# Altium project ptalk.PrjPcb
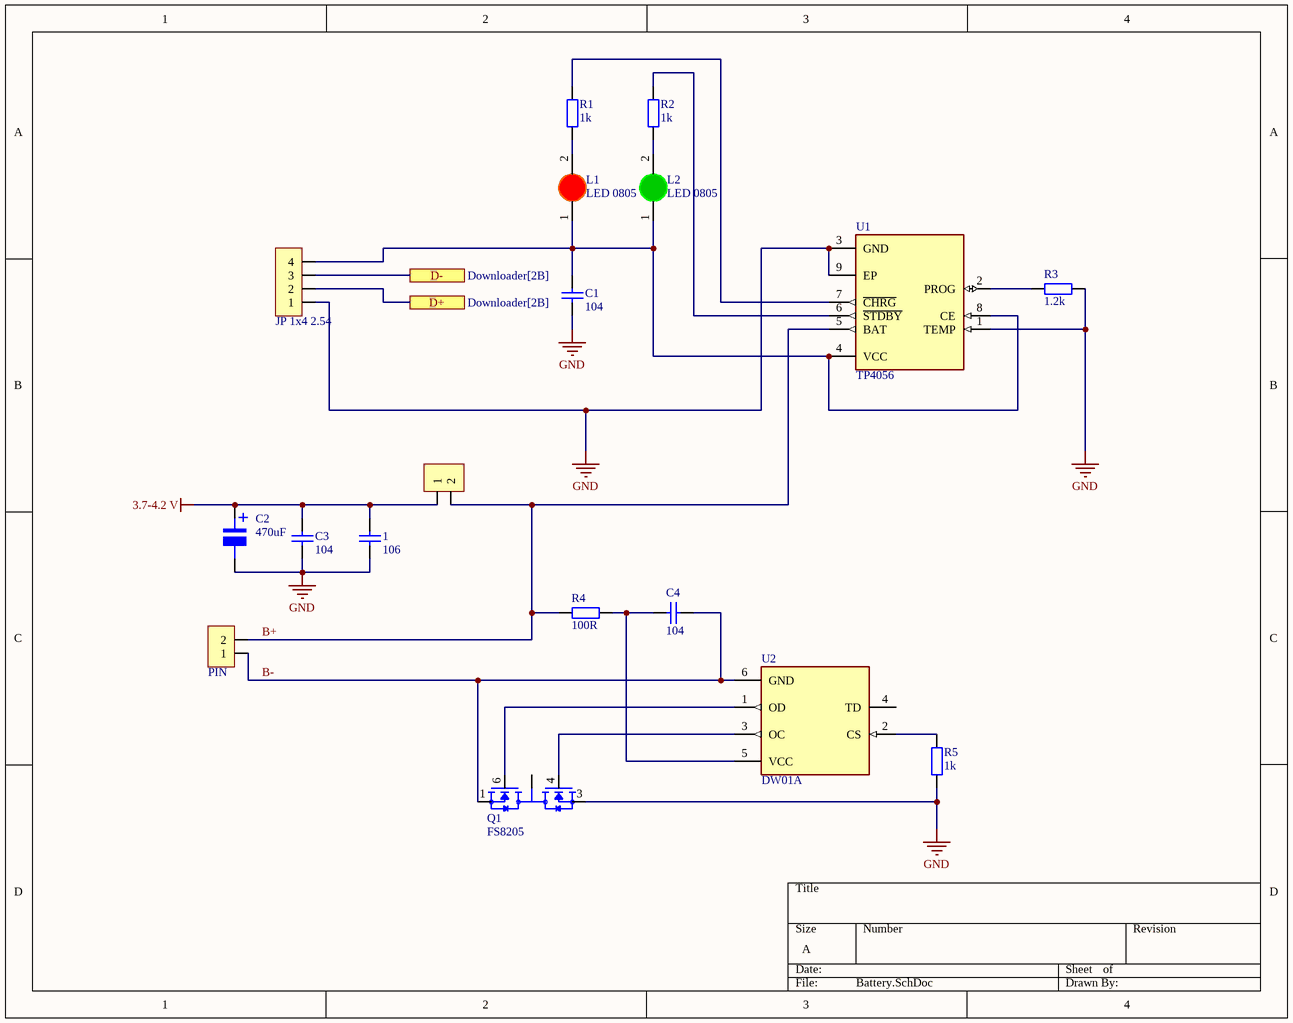
[diagram p0: Battery.SchDoc]
5 sheets, 59 parts. Net scope: flat (ports and power ports of the same name join across sheets).
Board file: PCB.PcbDoc
Sheets:
  Battery.SchDoc
  Source.SchDoc
  Downloader.SchDoc
  Media.SchDoc
  Esp32.SchDoc

## Sheet Battery.SchDoc
size A; SheetNumber: 1; SheetTotal: 5

### Parts
1  106  [tu 0805]
-_+  PIN  [JP 1x2 DT]
C1  104  [tu 0805]
C2  470uF  [tu nhom 8 (f)]
C3  104  [tu 0805]
C4  104  [tu 0805]
congtac  JP 1x2 2.54  [JP 1x2 DT]  (value not drawn)
GND_D+_D-_V  JP 1x4 2.54  [JP 1x4 DT]
L1  LED 0805  [LED-0805-Red]
L2  LED 0805  [LED-0805-Green]
Q1  FS8205  [SOT95P280X145-6N]
R1  1k  [tro smd 0805]
R2  1k  [tro smd 0805]
R3  1.2k  [tro smd 0805]
R4  100R  [tro smd 0805]
R5  1k  [tro smd 0805]
U1  TP4056  [SOP127P600X175-9N]
U2  DW01A  [SOT95P280X145-6N]

### Ports
D+ (see Downloader[2B]), D- (see Downloader[2B])

### Nets
3.7-4.2 V: 1.1 C2.1 C3.1 congtac.1
GND: 1.2 C1.2 C2.2 C3.2 GND_D+_D-_V.1 Q1.3(S2) R3.2 R5.1 U1.1(TEMP) U1.3(GND) U1.9(EP)
B+: -_+.2 congtac.2 R4.1 U1.5(BAT)
B-: -_+.1 C4.1 Q1.1(S1) U2.6(GND)
NetC1_1: C1.1 GND_D+_D-_V.4 L1.1(A) L2.1(A) U1.4(VCC) U1.8(CE)
NetC4_2: C4.2 R4.2 U2.5(VCC)
NetGND_D+_D-_V_2: GND_D+_D-_V.2 ; port D+
NetGND_D+_D-_V_3: GND_D+_D-_V.3 ; port D-
NetL1_2: L1.2(K) R1.1
NetL2_2: L2.2(K) R2.1
NetQ1_2: Q1.2(D12) Q1.5(D12)
NetQ1_4: Q1.4(G2) U2.3(OC)
NetQ1_6: Q1.6(G1) U2.1(OD)
NetR1_2: R1.2 U1.7(~{CHRG})
NetR2_2: R2.2 U1.6(~{STDBY})
NetR3_1: R3.1 U1.2(PROG)
NetR5_2: R5.2 U2.2(CS)

Not connected (* = marked no-connect by the designer): U2 4(TD)

### Notes on the sheet
- (in symbol Tu Nhom 470uF 16V) +

### Library data of the parts
1 = Tu 0805 106 16V 10%: Dán; Ten_Linh_Kien: Tụ 0805 106-10uF 10% 16V; So_Chan: 2; Don_Vi: Con; Ma_Hang: MH004553; Chung_Loai: Dán; Kieu_Chan: *
-_+ congtac = JP 1x2 2.54 Duc Thang: Cắm; Ten_Linh_Kien: Jump Đơn Đực 2.54MM 1x40P Thẳng 11MM; Don_Vi: Con; Ma_Hang: MH000903; Ghi_Chu: *; Kieu_Chan: *; Chung_Loai: Cắm
C1 C3 C4 = Tu 0805 104 50V 10%: Dán; Don_Vi: Con; So_Chan: 2; Ten_Linh_Kien: Tụ 0805 104-100nF 10% 50V; Ma_Hang: MH004551; Chung_Loai: Dán; Kieu_Chan: *
C2 = Tu Nhom 470uF 16V: Dán; Don_Vi: Con; So_Chan: 2; Ten_Linh_Kien: Tụ Nhôm 470uF 16V 8x10.4MM; Ma_Hang: MH001940; Chung_Loai: Dán; Kieu_Chan: *
GND_D+_D-_V = JP 1x4 2.54 Duc Thang: Cắm; Ten_Linh_Kien: Jump Đơn Đực 2.54MM 1x40P Thẳng 11MM; Don_Vi: Con; Ma_Hang: MH000903; Ghi_Chu: *; Kieu_Chan: *; Chung_Loai: Cắm
L1 = LED 0805 Do: Dán; Don_Vi: Con; Ma_Hang: MH000897; Ten_Linh_Kien: LED 0805 Màu Đỏ (Red); Ghi_Chu: *; Kieu_Chan: *; Chung_Loai: Dán
L2 = LED 0805 Xanh La: Dán; Don_Vi: Con; Ma_Hang: MH002326; Ten_Linh_Kien: LED 0805 Màu Xanh Lá (Green); Ghi_Chu: *; Kieu_Chan: *; Chung_Loai: Dán
Q1 = FS8205: ÐœÐžÐŸ-Ñ‚Ñ€Ð°Ð½Ð·Ð¸ÑÑ‚Ð¾Ñ€ Ñ Ð´Ð²Ð¾Ð¹Ð½Ñ‹Ð¼ N-ÐºÐ°Ð½Ð°Ð»ÑŒÐ½Ñ‹Ð¼ Ñ€ÐµÐ¶Ð¸Ð¼Ð¾Ð¼ ÑƒÑÐ¸Ð»ÐµÐ½Ð¸Ñ Ð¼Ð¾Ñ‰Ð½Ð¾ÑÑ‚Ð¸; MF: Fortune Semiconductor; SnapEDA_Link: https://www.snapeda.com/parts/FS8205/Fortune+Semiconductor/view-part/?ref=snap; Package: Package; Value: *; MP: FS8205; Check_prices: https://www.snapeda.com/parts/FS8205/Fortune+Semiconductor/view-part/?ref=eda
R1 R2 R5 = Tro 0805 5% 1k: Dán; Don_Vi: Con; So_Chan: 2; Ten_Linh_Kien: Trở 0805 5% 1k; Ma_Hang: MH005234; Chung_Loai: Dán; Kieu_Chan: *
R3 = Tro 0805 5% 1.2k: Dán; Don_Vi: Con; So_Chan: 2; Ten_Linh_Kien: Trở 0805 5% 1.2k; Ma_Hang: MH005231; Chung_Loai: Dán; Kieu_Chan: *
R4 = Tro 0805 5% 100R: Dán; Don_Vi: Con; So_Chan: 2; Ten_Linh_Kien: Trở 0805 5% 100R; Ma_Hang: MH005251; Chung_Loai: Dán; Kieu_Chan: *
U1 = TP4056: Complete single cell Li-Ion battery with a constant current / constant voltage linear charger; MF: NanJing Top Power ASIC Corp.; Check_prices: https://www.snapeda.com/parts/TP4056/NanJing+Top+Power+ASIC+Corp./view-part/?ref=eda; SnapEDA_Link: https://www.snapeda.com/parts/TP4056/NanJing+Top+Power+ASIC+Corp./view-part/?ref=snap; Price: None; Availability: Not in stock; Package: Package; MP: TP4056; Value: *
U2 = DW01A: One Cell Lithium-ion/Polymer Battery Protection IC; MF: Fortune Semiconductor; SnapEDA_Link: https://www.snapeda.com/parts/DW01A/Fortune+Semiconductor/view-part/?ref=snap; Package: SOT-23-6 Fortune Semiconductor; Value: *; MP: DW01A; Check_prices: https://www.snapeda.com/parts/DW01A/Fortune+Semiconductor/view-part/?ref=eda

## Sheet Source.SchDoc
size A; SheetNumber: 2; SheetTotal: 5
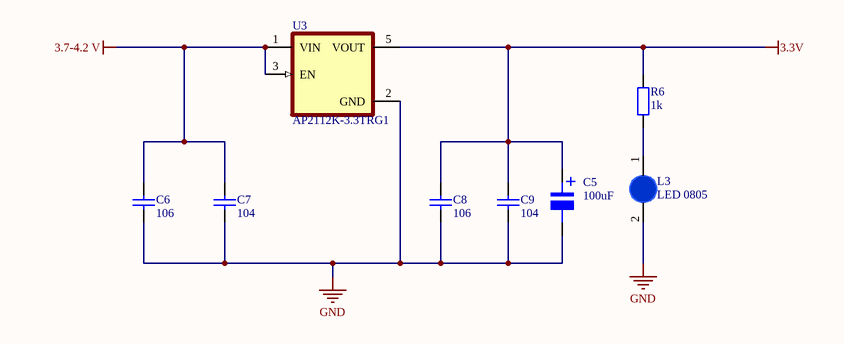
[diagram p1: Source.SchDoc]

### Parts
C5  100uF  [tu nhom 6.3 (d)]
C6  106  [tu 0805]
C7  104  [tu 0805]
C8  106  [tu 0805]
C9  104  [tu 0805]
L3  LED 0805  [LED-0805-Blue]
R6  1k  [tro smd 0805]
U3  AP2112K-3.3TRG1  [SOT95P285X140-5N]

### Nets
3.3V: C5.1 C8.1 C9.1 R6.2 U3.5(VOUT)
3.7-4.2 V: C6.1 C7.1 U3.1(VIN) U3.3(EN)
GND: C5.2 C6.2 C7.2 C8.2 C9.2 L3.2(K) U3.2(GND)
NetL3_1: L3.1(A) R6.1

### Notes on the sheet
- (in symbol Tu Nhom 100uF 16V) +

### Library data of the parts
C5 = Tu Nhom 100uF 16V: Dán; Don_Vi: Con; So_Chan: 2; Ten_Linh_Kien: Tụ Nhôm 100uF 16V 6.3x5.4MM; Ma_Hang: MH002219; Chung_Loai: Dán; Kieu_Chan: *
C6-C9 = Tu 0805 106 16V 10%: as 1 on sheet Battery; Chung_Loai: Dán; Kieu_Chan: *
L3 = LED 0805 Xanh Duong: Dán; Don_Vi: Con; Ma_Hang: MH002327; Ten_Linh_Kien: LED 0805 Màu Xanh Dương (Blue); Ghi_Chu: *; Kieu_Chan: *; Chung_Loai: Dán
R6 = Tro 0805 5% 1k: as R1 on sheet Battery; Chung_Loai: Dán; Kieu_Chan: *
U3 = AP2112K-3.3TRG1: Linear Voltage Regulator IC Positive Fixed 1 Output 600mA SOT-25; MF: Diodes Inc.; Value: *; Purchase-URL: https://pricing.snapeda.com/search/part/AP2112K-3.3TRG1/?ref=eda; Package: SOT-753 Diodes Inc.; Availability: In Stock; Check_prices: https://www.snapeda.com/parts/AP2112K-3.3TRG1/Diodes+Inc./view-part/?ref=eda; Price: None; SnapEDA_Link: https://www.snapeda.com/parts/AP2112K-3.3TRG1/Diodes+Inc./view-part/?ref=snap; MP: AP2112K-3.3TRG1

## Sheet Downloader.SchDoc
size A; SheetNumber: 3; SheetTotal: 5
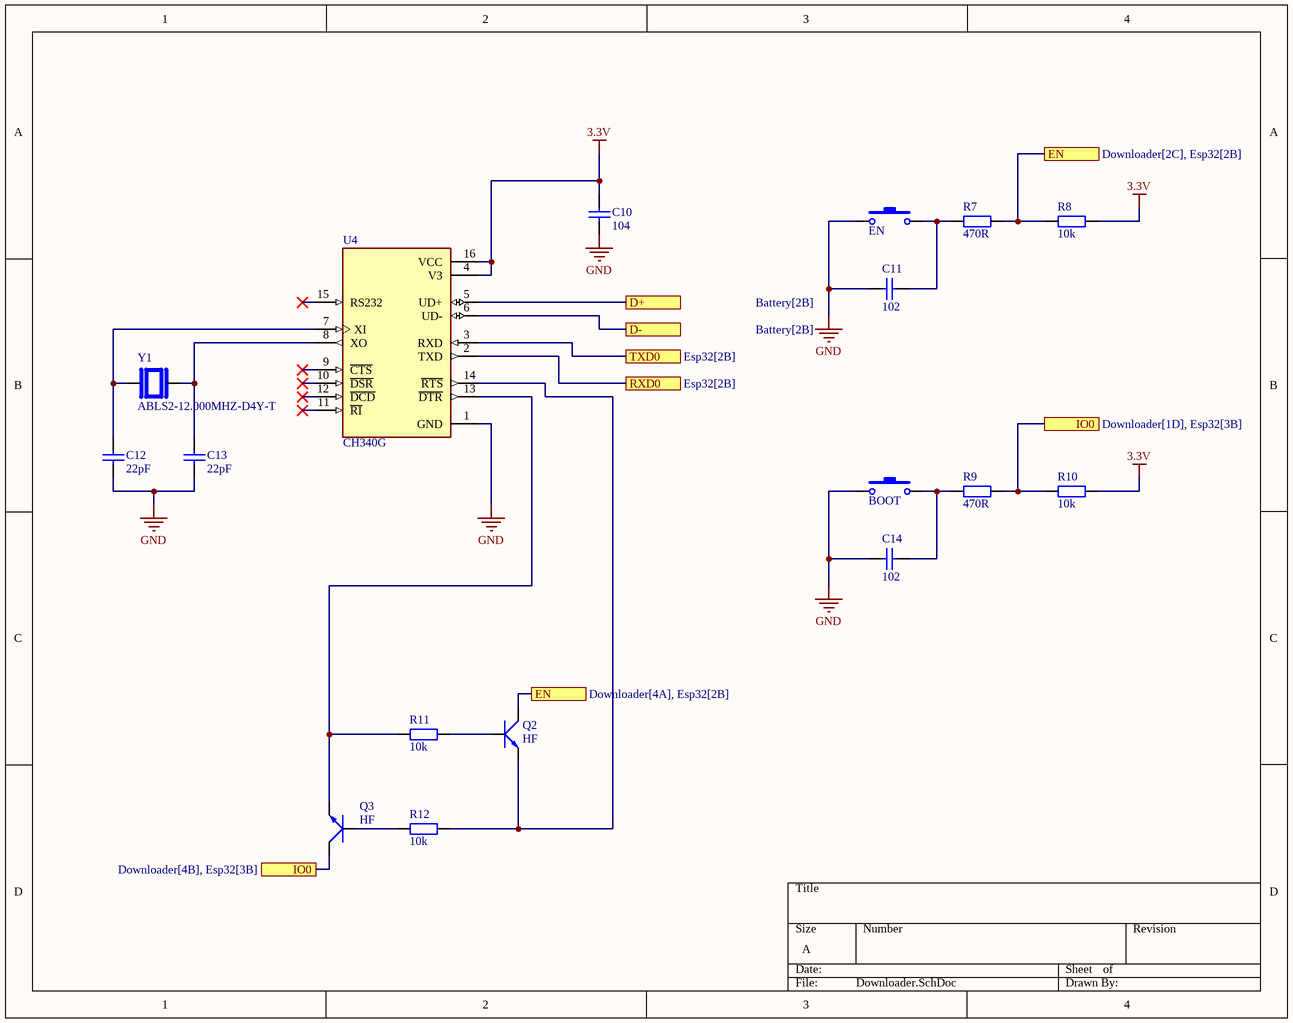
[diagram p2: Downloader.SchDoc]

### Parts
BOOT  Nut Nhan 2 Chan SMD 3x6x2.5  [Nut Nhan 2 Chan SMD 3x6x2.5]  (value not drawn)
C10  104  [tu 0805]
C11  102  [tu 0805]
C12  22pF  [tu 0805]
C13  22pF  [tu 0805]
C14  102  [tu 0805]
EN  Nut Nhan 2 Chan SMD 3x6x2.5  [Nut Nhan 2 Chan SMD 3x6x2.5]  (value not drawn)
Q2  HF  [SOT-23]
Q3  HF  [SOT-23]
R7  470R  [Tro SMD 0805]
R8  10k  [tro smd 0805]
R9  470R  [Tro SMD 0805]
R10  10k  [tro smd 0805]
R11  10k  [tro smd 0805]
R12  10k  [tro smd 0805]
U4  CH340G  [SOIC127P600X180-16N]
Y1  ABLS2-12.000MHZ-D4Y-T  [XTAL_ABLS2-12.000MHZ-D4Y-T]

### Ports
D+ (see Battery[2B]), D- (see Battery[2B]), EN (see Downloader[2C], Esp32[2B]), EN (see Downloader[4A], Esp32[2B]), IO0 (see Downloader[1D], Esp32[3B]), IO0 (see Downloader[4B], Esp32[3B]), RXD0 (see Esp32[2B]), TXD0 (see Esp32[2B])

### Nets
3.3V: C10.1 R8.2 R10.2 U4.4(V3) U4.16(VCC)
GND: BOOT.1 C10.2 C11.2 C12.2 C13.2 C14.2 EN.1 U4.1(GND)
NetBOOT_2: BOOT.2 C14.1 R9.1
NetC11_1: C11.1 EN.2 R7.1
NetC12_1: C12.1 U4.7(XI) Y1.1
NetC13_1: C13.1 U4.8(XO) Y1.2
NetGND_D+_D-_V_2: U4.5(UD+) ; port D+
NetGND_D+_D-_V_3: U4.6(UD-) ; port D-
NetQ2_1: Q2.1(B) R11.2
NetQ2_2: Q2.2(E) R12.2 U4.14(~{RTS})
NetQ2_3: Q2.3(C) R7.2 R8.1 ; port EN
NetQ3_1: Q3.1(B) R12.1
NetQ3_2: Q3.2(E) R11.1 U4.13(~{DTR})
NetQ3_3: Q3.3(C) R9.2 R10.1 ; port IO0
NetU4_2: U4.2(TXD) ; port RXD0
NetU4_3: U4.3(RXD) ; port TXD0

Not connected (* = marked no-connect by the designer): U4 9(~{CTS})* 10(~{DSR})* 11(~{RI})* 12(~{DCD})* 15(RS232)*

### Library data of the parts
BOOT EN = Nut Nhan 2 Chan SMD 3x6x2.5: Ma_Hang: MH001036; Ten: Nút Nhấn 2 Chân 3x6x2.5MM SMD
C10 = Tu 0805 104 50V 10%: as C1 on sheet Battery; Chung_Loai: Dán; Kieu_Chan: *
C11 C14 = Tu 0805 102 50V 10%: Dán; Don_Vi: Con; So_Chan: 2; Ten_Linh_Kien: Tụ 0805 102-1nF 10% 50V; Ma_Hang: MH004549; Chung_Loai: Dán; Kieu_Chan: *
C12 C13 = Tu 0805 22pF 50V 10%: Dán; Don_Vi: Con; So_Chan: 2; Ten_Linh_Kien: Tụ 0805 22P 10% 50V; Ma_Hang: MH004560; Chung_Loai: Dán; Kieu_Chan: *
Q2 Q3 = Trans C1815 HF SMD: SOT-23; Value: C9014
R7 R9 = Tro 0805 5% 470R: Dán; Don_Vi: Con; Ma_Hang: MH005341; Ten_Linh_Kien: Trở 0805 5% 470R; So_Chan: 2; Chung_Loai: Dán; Kieu_Chan: *
R8 R10-R12 = Tro 0805 5% 10k: Dán; Don_Vi: Con; So_Chan: 2; Ten_Linh_Kien: Trở 0805 5% 10k; Ma_Hang: MH005239; Chung_Loai: Dán; Kieu_Chan: *
U4 = CH340G: USB Interface Integrated Circuit; MF: WCH; Value: *; SnapEDA_Link: https://www.snapeda.com/parts/Ch340G/WCH/view-part/?ref=snap; MP: Ch340G; Check_prices: https://www.snapeda.com/parts/Ch340G/WCH/view-part/?ref=eda; Availability: Not in stock; Price: None; Package: None
Y1 = ABLS2-12.000MHZ-D4Y-T: HC/49US (AT49) LOW PROFILE SURFACE MOUNT MICROPROCESSOR CRYSTAL; MF: Abracon; Purchase-URL: https://pricing.snapeda.com/search/part/ABLS2-12.000MHZ-D4Y-T/?ref=eda; Package: HC49/US Abracon; MP: ABLS2-12.000MHZ-D4Y-T; Value: *; Price: None; Availability: In Stock; SnapEDA_Link: https://www.snapeda.com/parts/ABLS2-12.000MHZ-D4Y-T/Abracon+LLC/view-part/?ref=snap; Check_prices: https://www.snapeda.com/parts/ABLS2-12.000MHZ-D4Y-T/Abracon+LLC/view-part/?ref=eda

## Sheet Media.SchDoc
size A; SheetNumber: 4; SheetTotal: 5
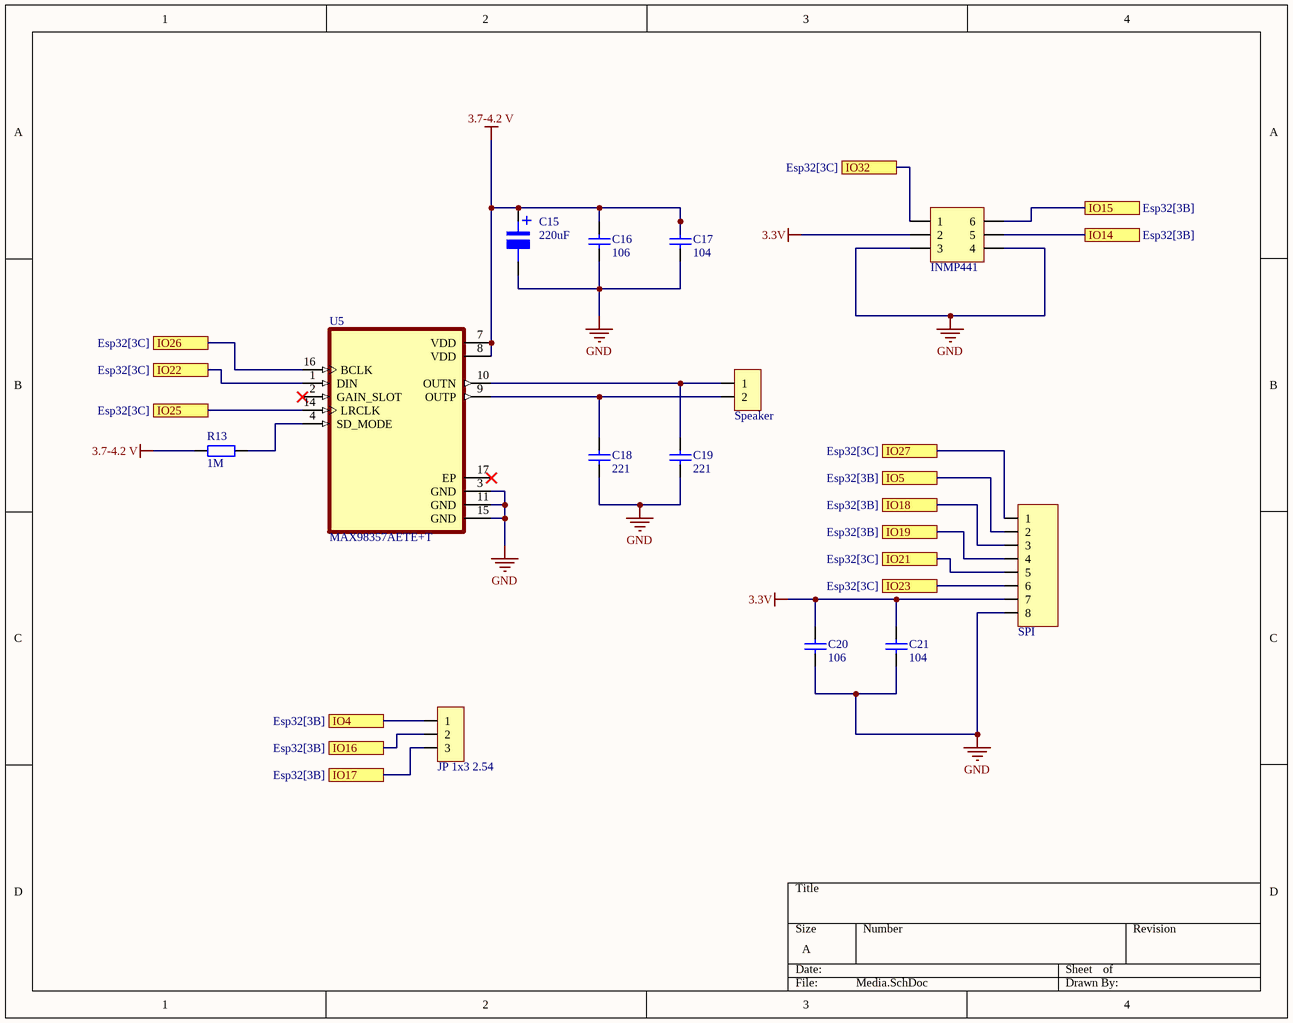
[diagram p3: Media.SchDoc]

### Parts
C15  220uF  [tu nhom 8 (e)]
C16  106  [tu 0805]
C17  104  [tu 0805]
C18  221  [tu 0805]
C19  221  [tu 0805]
C20  106  [tu 0805]
C21  104  [tu 0805]
GND_speaker  INMP441  [JP 2x3 DT]
JP7  JP 1x3 2.54  [JP 1x3 DT]
N_P  Speaker  [JP 1x2 DT]
R13  1M  [tro smd 0805]
SPI_3.3V_GND  SPI  [JP 1x8 DT]
U5  MAX98357AETE+T  [QFN50P300X300X80-17N]

### Ports
IO4 (see Esp32[3B]), IO5 (see Esp32[3B]), IO14 (see Esp32[3B]), IO15 (see Esp32[3B]), IO16 (see Esp32[3B]), IO17 (see Esp32[3B]), IO18 (see Esp32[3B]), IO19 (see Esp32[3B]), IO21 (see Esp32[3C]), IO22 (see Esp32[3C]), IO23 (see Esp32[3C]), IO25 (see Esp32[3C]), IO26 (see Esp32[3C]), IO27 (see Esp32[3C]), IO32 (see Esp32[3C])

### Nets
3.3V: C20.1 C21.1 GND_speaker.2 SPI_3.3V_GND.7
3.7-4.2 V: C15.1 C16.1 C17.1 R13.1 U5.7(VDD) U5.8(VDD)
GND: C15.2 C16.2 C17.2 C18.2 C19.2 C20.2 C21.2 GND_speaker.3 GND_speaker.4 SPI_3.3V_GND.8 U5.3(GND) U5.11(GND) U5.15(GND)
NetC18_1: C18.1 N_P.2 U5.9(OUTP)
NetC19_1: C19.1 N_P.1 U5.10(OUTN)
NetGND_speaker_1: GND_speaker.1 ; port IO32
NetGND_speaker_5: GND_speaker.5 ; port IO14
NetGND_speaker_6: GND_speaker.6 ; port IO15
NetJP7_1: JP7.1 ; port IO4
NetJP7_2: JP7.2 ; port IO16
NetJP7_3: JP7.3 ; port IO17
NetR13_2: R13.2 U5.4(SD_MODE)
NetSPI_3.3V_GND_1: SPI_3.3V_GND.1 ; port IO27
NetSPI_3.3V_GND_2: SPI_3.3V_GND.2 ; port IO5
NetSPI_3.3V_GND_3: SPI_3.3V_GND.3 ; port IO18
NetSPI_3.3V_GND_4: SPI_3.3V_GND.4 ; port IO19
NetSPI_3.3V_GND_5: SPI_3.3V_GND.5 ; port IO21
NetSPI_3.3V_GND_6: SPI_3.3V_GND.6 ; port IO23
NetU5_1: U5.1(DIN) ; port IO22
NetU5_14: U5.14(LRCLK) ; port IO25
NetU5_16: U5.16(BCLK) ; port IO26

Not connected (* = marked no-connect by the designer): U5 2(GAIN_SLOT)* 17(EP)*

### Notes on the sheet
- (in symbol Tu Nhom 220uF 10V) +

### Library data of the parts
C15 = Tu Nhom 220uF 10V: Dán; So_Chan: 2; Ten_Linh_Kien: Tụ Nhôm 220uF 10V; Ma_Hang: MH004021; Don_Vi: Con; Chung_Loai: Dán; Kieu_Chan: *
C16 C20 C21 = Tu 0805 106 16V 10%: as 1 on sheet Battery; Chung_Loai: Dán; Kieu_Chan: *
C17 = Tu 0805 104 50V 10%: as C1 on sheet Battery; Chung_Loai: Dán; Kieu_Chan: *
C18 C19 = Tu 0805 221 50V: Dán; Don_Vi: Con; So_Chan: 2; Ten_Linh_Kien: Tụ 0805 221-220P 50V; Ma_Hang: MH007365; Chung_Loai: Dán; Kieu_Chan: *
GND_speaker = JP 2x3 2.54 Duc Thang: Cắm; Ten_Linh_Kien: Jump Đôi Đực 2.54MM 2x40P Thẳng 11MM; Don_Vi: Con; Ma_Hang: MH002686; Ghi_Chu: *; Kieu_Chan: *; Chung_Loai: Cắm
JP7 = JP 1x3 2.54 Duc Thang: Cắm; Ten_Linh_Kien: Jump Đơn Đực 2.54MM 1x40P Thẳng 11MM; Don_Vi: Con; Ma_Hang: MH000903; Ghi_Chu: *; Kieu_Chan: *; Chung_Loai: Cắm
N_P = JP 1x2 2.54 Duc Thang: as -_+ on sheet Battery; Ghi_Chu: *; Kieu_Chan: *; Chung_Loai: Cắm
R13 = Tro 0805 5% 1M: Dán; Don_Vi: Con; So_Chan: 2; Ten_Linh_Kien: Trở 0805 5% 1M; Ma_Hang: MH005235; Chung_Loai: Dán; Kieu_Chan: *
SPI_3.3V_GND = JP 1x8 2.54 Duc Thang: Cắm; Ten_Linh_Kien: Jump Đơn Đực 2.54MM 1x40P Thẳng 11MM; Don_Vi: Con; Ma_Hang: MH000903; Ghi_Chu: *; Kieu_Chan: *; Chung_Loai: Cắm
U5 = MAX98357AETE+T: Tiny, Low-Cost, PCM Class D Amplifier with Class AB Performance; MF: Analog Devices; SnapEDA_Link: https://www.snapeda.com/parts/MAX98357AETE+T/Analog+Devices/view-part/?ref=snap; Package: TQFN-16 Maxim; Value: *; MP: MAX98357AETE+T; Check_prices: https://www.snapeda.com/parts/MAX98357AETE+T/Analog+Devices/view-part/?ref=eda

## Sheet Esp32.SchDoc
size A; SheetNumber: 5; SheetTotal: 5
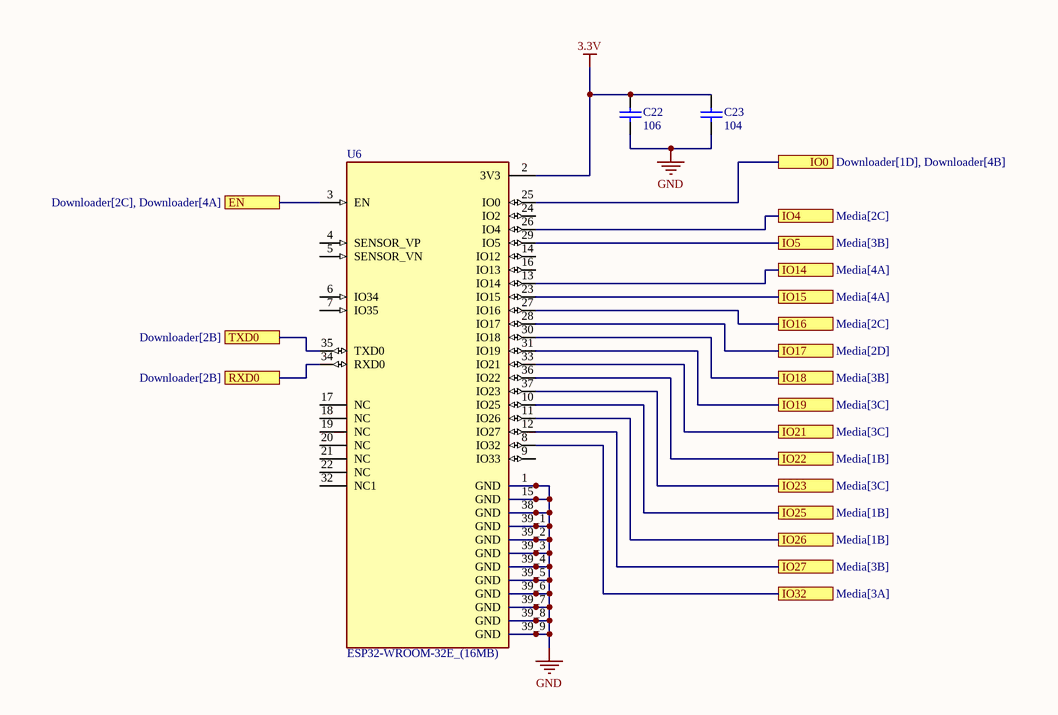
[diagram p4: Esp32.SchDoc]

### Parts
C22  106  [tu 0805]
C23  104  [tu 0805]
U6  ESP32-WROOM-32E_(16MB)  [XCVR_ESP32-WROOM-32E_(16MB)]

### Ports
EN (see Downloader[2C], Downloader[4A]), IO0 (see Downloader[1D], Downloader[4B]), IO4 (see Media[2C]), IO5 (see Media[3B]), IO14 (see Media[4A]), IO15 (see Media[4A]), IO16 (see Media[2C]), IO17 (see Media[2D]), IO18 (see Media[3B]), IO19 (see Media[3C]), IO21 (see Media[3C]), IO22 (see Media[1B]), IO23 (see Media[3C]), IO25 (see Media[1B]), IO26 (see Media[1B]), IO27 (see Media[3B]), IO32 (see Media[3A]), RXD0 (see Downloader[2B]), TXD0 (see Downloader[2B])

### Nets
3.3V: C22.1 C23.1 U6.2(3V3)
GND: C22.2 C23.2 U6.1(GND) U6.15(GND) U6.38(GND) U6.39_1(GND) U6.39_2(GND) U6.39_3(GND) U6.39_4(GND) U6.39_5(GND) U6.39_6(GND) U6.39_7(GND) U6.39_8(GND) U6.39_9(GND)
NetGND_speaker_1: U6.8(IO32) ; port IO32
NetGND_speaker_5: U6.13(IO14) ; port IO14
NetGND_speaker_6: U6.23(IO15) ; port IO15
NetJP7_1: U6.26(IO4) ; port IO4
NetJP7_2: U6.27(IO16) ; port IO16
NetJP7_3: U6.28(IO17) ; port IO17
NetQ2_3: U6.3(EN) ; port EN
NetQ3_3: U6.25(IO0) ; port IO0
NetSPI_3.3V_GND_1: U6.12(IO27) ; port IO27
NetSPI_3.3V_GND_2: U6.29(IO5) ; port IO5
NetSPI_3.3V_GND_3: U6.30(IO18) ; port IO18
NetSPI_3.3V_GND_4: U6.31(IO19) ; port IO19
NetSPI_3.3V_GND_5: U6.33(IO21) ; port IO21
NetSPI_3.3V_GND_6: U6.37(IO23) ; port IO23
NetU4_2: U6.34(RXD0) ; port RXD0
NetU4_3: U6.35(TXD0) ; port TXD0
NetU5_1: U6.36(IO22) ; port IO22
NetU5_14: U6.10(IO25) ; port IO25
NetU5_16: U6.11(IO26) ; port IO26

Not connected (* = marked no-connect by the designer): U6 4(SENSOR_VP) 5(SENSOR_VN) 6(IO34) 7(IO35) 9(IO33) 14(IO12) 16(IO13) 17(NC) 18(NC) 19(NC) 20(NC) 21(NC) 22(NC) 24(IO2) 32(NC1)

### Library data of the parts
C22 C23 = Tu 0805 106 16V 10%: as 1 on sheet Battery; Chung_Loai: Dán; Kieu_Chan: *
U6 = ESP32-WROOM-32E_(16MB): Bluetooth, WiFi 802.11b/g/n, Bluetooth v4.2 +EDR, Class 1, 2 and 3 Transceiver Module 2.4GHz ~ 2.5GHz Integrated, Trace Surface Mount; MP: ESP32-WROOM-32E (16MB); MF: Espressif Systems; Price: None; Availability: Not in stock; Package: None; Value: *; SnapEDA_Link: https://www.snapeda.com/parts/ESP32-WROOM-32E%20(16MB)/Espressif+Systems/view-part/?ref=snap; Check_prices: https://www.snapeda.com/parts/ESP32-WROOM-32E%20(16MB)/Espressif+Systems/view-part/?ref=eda

## Nets that join several sheets
3.3V: Source (5 pins), Downloader (5 pins), Media (C20.1 C21.1 GND_speaker.2 SPI_3.3V_GND.7), Esp32 (C22.1 C23.1 U6.2)
3.7-4.2 V: Battery (1.1 C2.1 C3.1 congtac.1), Source (C6.1 C7.1 U3.1 U3.3), Media (6 pins)
GND: Battery (11 pins), Source (7 pins), Downloader (8 pins), Media (13 pins), Esp32 (14 pins)
NetGND_D+_D-_V_2: Battery (GND_D+_D-_V.2), Downloader (U4.5)
NetGND_D+_D-_V_3: Battery (GND_D+_D-_V.3), Downloader (U4.6)
NetGND_speaker_1: Media (GND_speaker.1), Esp32 (U6.8)
NetGND_speaker_5: Media (GND_speaker.5), Esp32 (U6.13)
NetGND_speaker_6: Media (GND_speaker.6), Esp32 (U6.23)
NetJP7_1: Media (JP7.1), Esp32 (U6.26)
NetJP7_2: Media (JP7.2), Esp32 (U6.27)
NetJP7_3: Media (JP7.3), Esp32 (U6.28)
NetQ2_3: Downloader (Q2.3 R7.2 R8.1), Esp32 (U6.3)
NetQ3_3: Downloader (Q3.3 R9.2 R10.1), Esp32 (U6.25)
NetSPI_3.3V_GND_1: Media (SPI_3.3V_GND.1), Esp32 (U6.12)
NetSPI_3.3V_GND_2: Media (SPI_3.3V_GND.2), Esp32 (U6.29)
NetSPI_3.3V_GND_3: Media (SPI_3.3V_GND.3), Esp32 (U6.30)
NetSPI_3.3V_GND_4: Media (SPI_3.3V_GND.4), Esp32 (U6.31)
NetSPI_3.3V_GND_5: Media (SPI_3.3V_GND.5), Esp32 (U6.33)
NetSPI_3.3V_GND_6: Media (SPI_3.3V_GND.6), Esp32 (U6.37)
NetU4_2: Downloader (U4.2), Esp32 (U6.34)
NetU4_3: Downloader (U4.3), Esp32 (U6.35)
NetU5_1: Media (U5.1), Esp32 (U6.36)
NetU5_14: Media (U5.14), Esp32 (U6.10)
NetU5_16: Media (U5.16), Esp32 (U6.11)